# Altium schematic sheet SuperCap UPS.SchDoc: SuperCap UPS
size Letter; Author: Alfredo Cortellini; Organization: IT Logic; Address1: 5753 Highway 85 N; Address2: Crestview, FL 32536; Address3: United States; DocumentNumber: 5; SheetNumber: 5; SheetTotal: 5; Email: pcb-design@itlogic.cloud
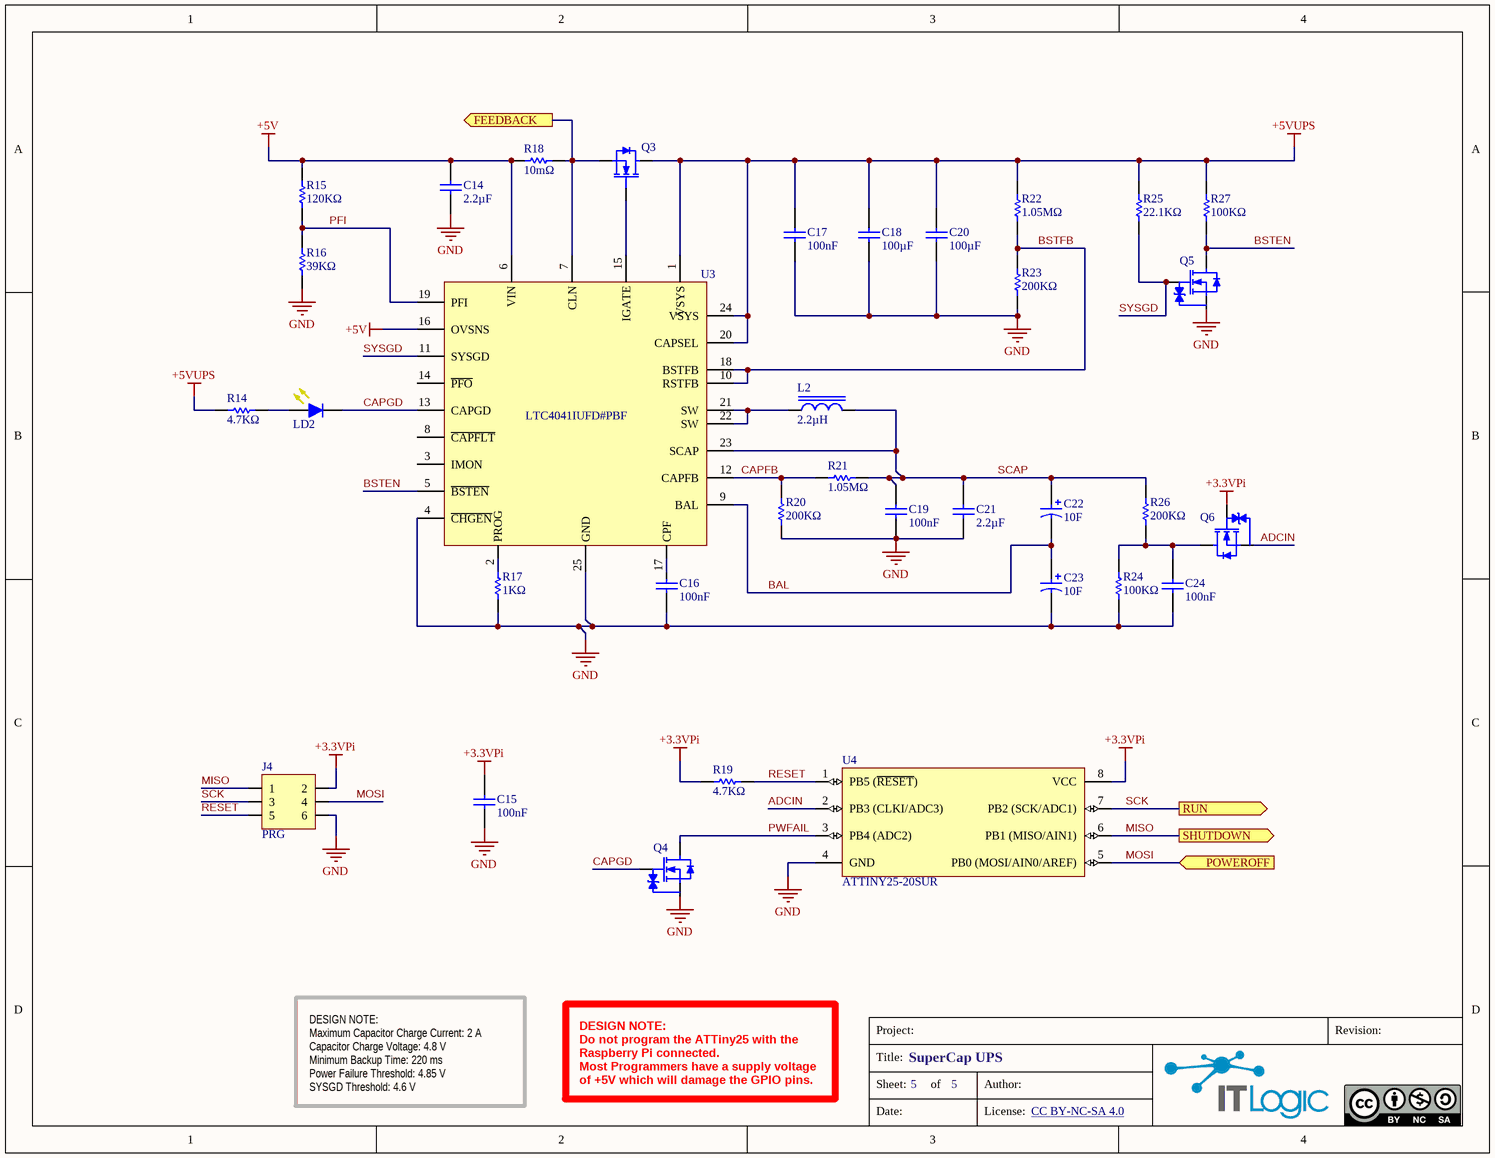
[diagram p0: SuperCap UPS.SchDoc]

## Parts
C14  2.2µF  [C0805-H140]
C15  100nF  [C0805-H10]
C16  100nF  [C0805-H10]
C17  100nF  [C0805-H10]
C18  100µF  [C1210-H250]
C19  100nF  [C0805-H10]
C20  100µF  [C1210-H250]
C21  2.2µF  [C0805-H140]
C22  10F  [C-SCCT20B106PRB-ORIZ]
C23  10F  [C-SCCT20B106PRB-ORIZ]
C24  100nF  [C0805-H10]
J4  PRG  [HDR-V-2R-03P-5.8L]
L2  2.2µH  [IND-XAL5030]
LD2  LTST-S220KSKT  [LED-0805-Y-SIDE]  (value not drawn)
Q3  SISA88DN-T1-GE3  [POWERPAK-1212-8-S]  (value not drawn)
Q4  BSS138K-13  [SOT-23]  (value not drawn)
Q5  BSS138K-13  [SOT-23]  (value not drawn)
Q6  BSS138K-13  [SOT-23]  (value not drawn)
R14  4.7KΩ  [R0805-H60]
R15  120KΩ  [R0805-H60]
R16  39KΩ  [R0805-H60]
R17  1KΩ  [R0805-H60]
R18  10mΩ  [R0508-H60]
R19  4.7KΩ  [R0805-H60]
R20  200KΩ  [R0805-H60]
R21  1.05MΩ  [R0805-H60]
R22  1.05MΩ  [R0805-H60]
R23  200KΩ  [R0805-H60]
R24  100KΩ  [R0805-H60]
R25  22.1KΩ  [R0805-H60]
R26  200KΩ  [R0805-H60]
R27  100KΩ  [R0805-H60]
U3  LTC4041IUFD#PBF  [QFN-50x40-24-THP]
U4  ATTINY25-20SUR  [SOIC-8-W]

## Ports
FEEDBACK (out), POWEROFF (in), RUN (out), SHUTDOWN (out)

## Nets
+3.3VPi: C15.2 J4.2 Q6.1(G) R19.1 U4.8(VCC)
+5V: C14.2 R15.2 R18.1 U3.6(VIN) U3.16(OVSNS)
+5VUPS: C17.2 C18.2 C20.2 Q3.3(D) R14.1 R22.2 R25.2 R27.2 U3.1(VSYS) U3.20(CAPSEL) U3.24(VSYS)
GND: C14.1 C15.1 C16.1 C17.1 C18.1 C19.1 C20.1 C21.1 C23.2 C24.1 J4.6 Q4.2(S) Q5.2(S) R16.1 R17.1 R20.1 R23.1 R24.1 U3.4(~{CHGEN}) U3.25(GND) U4.4(GND)
ADCIN: Q6.2(S) U4.2(PB3_(CLKI/ADC3))
BAL: C22.2 C23.1 U3.9(BAL)
BSTEN: Q5.3(D) R27.1 U3.5(~{BSTEN})
BSTFB: R22.1 R23.2 U3.10(RSTFB) U3.18(BSTFB)
CAPFB: R20.2 R21.1 U3.12(CAPFB)
CAPGD: LD2.1(K) Q4.1(G) U3.13(CAPGD)
FEEDBACK: Q3.1(S) R18.2 U3.7(CLN) ; port FEEDBACK
MISO: J4.1 U4.6(PB1_(MISO/AIN1)) ; port SHUTDOWN
MOSI: J4.4 U4.5(PB0_(MOSI/AIN0/AREF)) ; port POWEROFF
PFI: R15.1 R16.2 U3.19(PFI)
PWFAIL: Q4.3(D) U4.3(PB4_(ADC2))
RESET: J4.5 R19.2 U4.1(PB5_(~{RESET}))
SCAP: C19.2 C21.2 C22.1 L2.2 R21.2 R26.2 U3.23(SCAP)
SCK: J4.3 U4.7(PB2_(SCK/ADC1)) ; port RUN
SYSGD: Q5.1(G) R25.1 U3.11(SYSGD)
NetC16_2: C16.2 U3.17(CPF)
NetC24_2: C24.2 Q6.3(D) R24.2 R26.1
NetL2_1: L2.1 U3.21(SW) U3.22(SW)
NetLD2_2: LD2.2(A) R14.2
NetQ3_2: Q3.2(G) U3.15(IGATE)
NetR17_2: R17.2 U3.2(PROG)

Not connected (* = marked no-connect by the designer): U3 3(IMON) 8(~{CAPFLT}) 14(~{PFO})

## Notes on the sheet
- DESIGN NOTE:
  Maximum Capacitor Charge Current: 2 A
  Capacitor Charge Voltage: 4.8 V
  Minimum Backup Time: 220 ms
  Power Failure Threshold: 4.85 V
  SYSGD Threshold: 4.6 V
- DESIGN NOTE:
  Do not program the ATTiny25 with the Raspberry Pi connected.
  Most Programmers have a supply voltage of +5V which will damage the GPIO pins.
- Project:
- Revision:
- Title:
- Sheet:
- of
- Author:
- Date:
- License:
- CC BY-NC-SA 4.0 <https://creativecommons.org/licenses/by-nc-sa/4.0/>

## Library data of the parts
C14 C21 = C0805C225K4RACTU: Cap 0805 Case Ceramic 2.2uF 16V X7R 10%; Manufacturer: KEMET; Capacitance: 22uF; Value: 2.2u; Manufacturer Part Number: C0805C225K4RACTU; Mount: Surface Mount; Case: 0805; Dielectric: X7R; Voltage Rating: 16V; ComponentLink1URL: http://components.arrow.com/part/dataview/0323_07281823; ComponentLink1Description: Data Sheet
C15-C17 C19 C24 = C0805C104K5RACTU: Cap 0805 Case Ceramic 100nF 50V X7R; Manufacturer: KEMET; Value: 100n; Manufacturer Part Number: C0805C104K5RACTU; Mount: Surface Mount; Case: 0805; Capacitance: 100nF; Dielectric: X7R; Voltage Rating: 50V; ComponentLink1URL: https://datasheet.ciiva.com/14589/70095383-14589048.pdf; ComponentLink1Description: Data Sheet
C18 C20 = GRM32ER61A107ME20L: Cap 1210 Case Ceramic 100uF 10V X5S 20%; Manufacturer: Murata; Dielectric: X5R; Value: 100u; Manufacturer Part Number: GRM32ER61A107ME20L; Mount: Surface Mount; Case: 1210; Capacitance: 100uF; Voltage Rating: 10V; ComponentLink1URL: https://www.mouser.com/datasheet/2/400/lcc_commercial_general_en-837201.pdf; ComponentLink1Description: Data Sheet
C22 C23 = SCCT20E106SRB: Cap Super 10F 3.0V (20 X 12.5mm) ESR 50mOhm; Manufacturer: AVX; Resistance: 0.05R; Value: 10; Manufacturer Part Number: SCCT20E106SRB; Mount: Through Hole; Capacitance: 10F; Voltage Rating: 3.0V; ComponentLink1URL: https://datasheet.ciiva.com/3773/41677623s8437994n1386-3773397.pdf; ComponentLink1Description: Data Sheet
J4 = 5-146256-3: Breakaway Header Vert - 2 Row - 3 Pos - 6 mm Lenght - Gold; Manufacturer: TE Connectivity; Current Rating: 3A; Manufacturer Part Number: 5-146256-3; Mount: Through Hole; ComponentLink1URL: https://datasheet.ciiva.com/16290/eng-cd-146256-f2-16290485.pdf; ComponentLink1Description: Data Sheet
L2 = XAL5030-222MEB: Inductor Power SRP6540 Series, 2.2uH, 9.7A,  Shielded, 0.0132 ohm, SMD; Manufacturer: Coilcraft; Value: 2.2u; Manufacturer Part Number: XAL5030-222MEB; Inductance: 2.2uH; ComponentLink1URL: https://www.coilcraft.com/xal50xx.cfm; ComponentLink1Description: Data Sheet; Mount: Surface Mount
LD2 = LTST-S220KSKT: LED 0805 Side Yellow 588nm 2-Pin; Manufacturer: Vishay Lite-On; Manufacturer Part Number: LTST-S220KSKT; Mount: Surface Mount; Case: 0805; ComponentLink1URL: https://www.mouser.com/datasheet/2/239/Lite-On-LTST-S220KSKT-1175446.pdf; ComponentLink1Description: Data Sheet
Q3 = SISA88DN-T1-GE3: Mosfet 30V Vds 20V Vgs 5.4mOhm PowerPAK 1212-8; Manufacturer: Vishay; Manufacturer Part Number: SISA88DN-T1-GE3; Mount: Surface Mount; Case: PowerPAK 1212-8; ComponentLink1Description: Data Sheet; ComponentLink1URL: https://www.vishay.com/docs/76062/sisa88dn.pdf
Q4-Q6 = BSS138K-13: Mosfet N 50V Vds 20V Vgs ESD 1.4R SOT-23; Manufacturer: Diodes; Manufacturer Part Number: BSS138K-13; Mount: Surface Mount; Case: SOT-23; ComponentLink1Description: Data Sheet; ComponentLink1URL: https://www.diodes.com/assets/Datasheets/BSS138K.pdf
R14 R19 = RC0805FR-074K7L: Resistor 0805 Case 4.7KR 1% 1/8W; Manufacturer: Yageo; Voltage Rating: 150V; Value: 4.7K; Manufacturer Part Number: RC0805FR-074K7L; Case: 0805; Resistance: 4.7kR; ComponentLink1URL: https://datasheet.ciiva.com/11808/0900766b8106beab-11808155.pdf; ComponentLink1Description: Data Sheet; Mount: Surface Mount
R15 = RC0805FR-07120KL: Resistor 0805 Case 120KR 1% 1/8W; Manufacturer: Yageo; Voltage Rating: 150V; Value: 120K; Manufacturer Part Number: RC0805FR-07120KL; Case: 0805; Resistance: 120kR; ComponentLink1URL: https://datasheet.ciiva.com/2457/pyu-r-int-thick-7-2457752.pdf; ComponentLink1Description: Data Sheet; Mount: Surface Mount
R16 = RC0805FR-0739KL: Resistor 0805 Case 39KR 1% 1/8W; Manufacturer: Yageo; Voltage Rating: 150V; Value: 39K; Manufacturer Part Number: RC0805FR-0739KL; Case: 0805; Resistance: 39KR; ComponentLink1URL: https://datasheet.ciiva.com/11808/0900766b8106beab-11808155.pdf; ComponentLink1Description: Data Sheet; Mount: Surface Mount
R17 = RC0805FR-071KL: Resistor 0805 Case 1KR 1% 1/8W; Manufacturer: Yageo; Voltage Rating: 150V; Value: 1K; Manufacturer Part Number: RC0805FR-071KL; Case: 0805; Resistance: 1kR; ComponentLink1URL: https://datasheet.ciiva.com/2456/pyu-r-int-thick-7-2456976.pdf; ComponentLink1Description: Data Sheet; Mount: Surface Mount
R18 = KRL2012E-M-R010-F-T5: Resistor 0508 Case 10mR 1% 1/2W Current Sense; Manufacturer: Susumu; Voltage Rating: 10V; Value: 10m; Manufacturer Part Number: KRL2012E-M-R010-F-T5; Case: 0508; Resistance: 10mR; ComponentLink1URL: https://datasheet.ciiva.com/2484/wsr-2484454.pdf; ComponentLink1Description: Data Sheet; Mount: Surface Mount
R20 R23 R26 = RC0805FR-07200KL: Resistor 0805 Case 200KR 1% 1/8W; Manufacturer: Yageo; Voltage Rating: 150V; Value: 200K; Manufacturer Part Number: RC0805FR-07200KL; Case: 0805; Resistance: 200kR; ComponentLink1URL: https://datasheet.ciiva.com/2457/pyu-r-int-thick-7-2457017.pdf; ComponentLink1Description: Data Sheet; Mount: Surface Mount
R21 R22 = RC0805FR-071M05L: Resistor 0805 Case 1.05MR 1% 1/8W; Manufacturer: Yageo; Voltage Rating: 150V; Value: 1.05M; Manufacturer Part Number: RC0805FR-071M05L; Case: 0805; Resistance: 1.05MR; ComponentLink1URL: https://datasheet.ciiva.com/2457/pyu-r-int-thick-7-2457017.pdf; ComponentLink1Description: Data Sheet; Mount: Surface Mount
R24 R27 = RC0805FR-07100KL: Resistor 0805 Case 100KR 1% 1/8W; Manufacturer: Yageo; Voltage Rating: 150V; Value: 100K; Manufacturer Part Number: RC0805FR-07100KL; Case: 0805; Resistance: 100kR; ComponentLink1URL: https://datasheet.ciiva.com/2457/pyu-r-int-thick-7-2457017.pdf; ComponentLink1Description: Data Sheet; Mount: Surface Mount
R25 = RC0805FR-0722K1L: Resistor 0805 Case 22.1KR 1% 1/8W; Manufacturer: Yageo; Voltage Rating: 150V; Value: 22.1K; Manufacturer Part Number: RC0805FR-0722K1L; Case: 0805; Resistance: 22.1kR; ComponentLink1URL: https://datasheet.ciiva.com/2457/pyu-r-int-thick-7-2457521.pdf; ComponentLink1Description: Data Sheet; Mount: Surface Mount
U3 = LTC4041IUFD#PBF: Power Management 2.5A Supercapacitor Backup Buck Converter and Charger; Manufacturer: Analog Devices; Manufacturer Part Number: LTC4041IUFD#PBF; Mount: Surface Mount; Case: QFN-24; ComponentLink1URL: http://www.ti.com/lit/ds/symlink/lmr23630.pdf; ComponentLink1Description: Data Sheet
U4 = ATTINY25-20SUR: AVR MCU8-bit ATTiny - 2kB Flash 0.128kB EEPROM 6 I/O Pins - SOIC-8-W; Manufacturer: Microchip; Frequency: 20MHz; Manufacturer Part Number: ATTINY25-20SUR; Mount: Surface Mount; Case: SOIC-8-W; ComponentLink1URL: http://ww1.microchip.com/downloads/en/DeviceDoc/PIC16-L-F15313_23-Data-Sheet-40001897B.pdf; ComponentLink1Description: Data Sheet